# EAGLE design usbc-hub (EAGLE 9.4.2)
CNAME: PepeTech; CREVISION: 1; DESIGNER: Joao Silva

## Sheet 1 of 5: Upstream USB-C
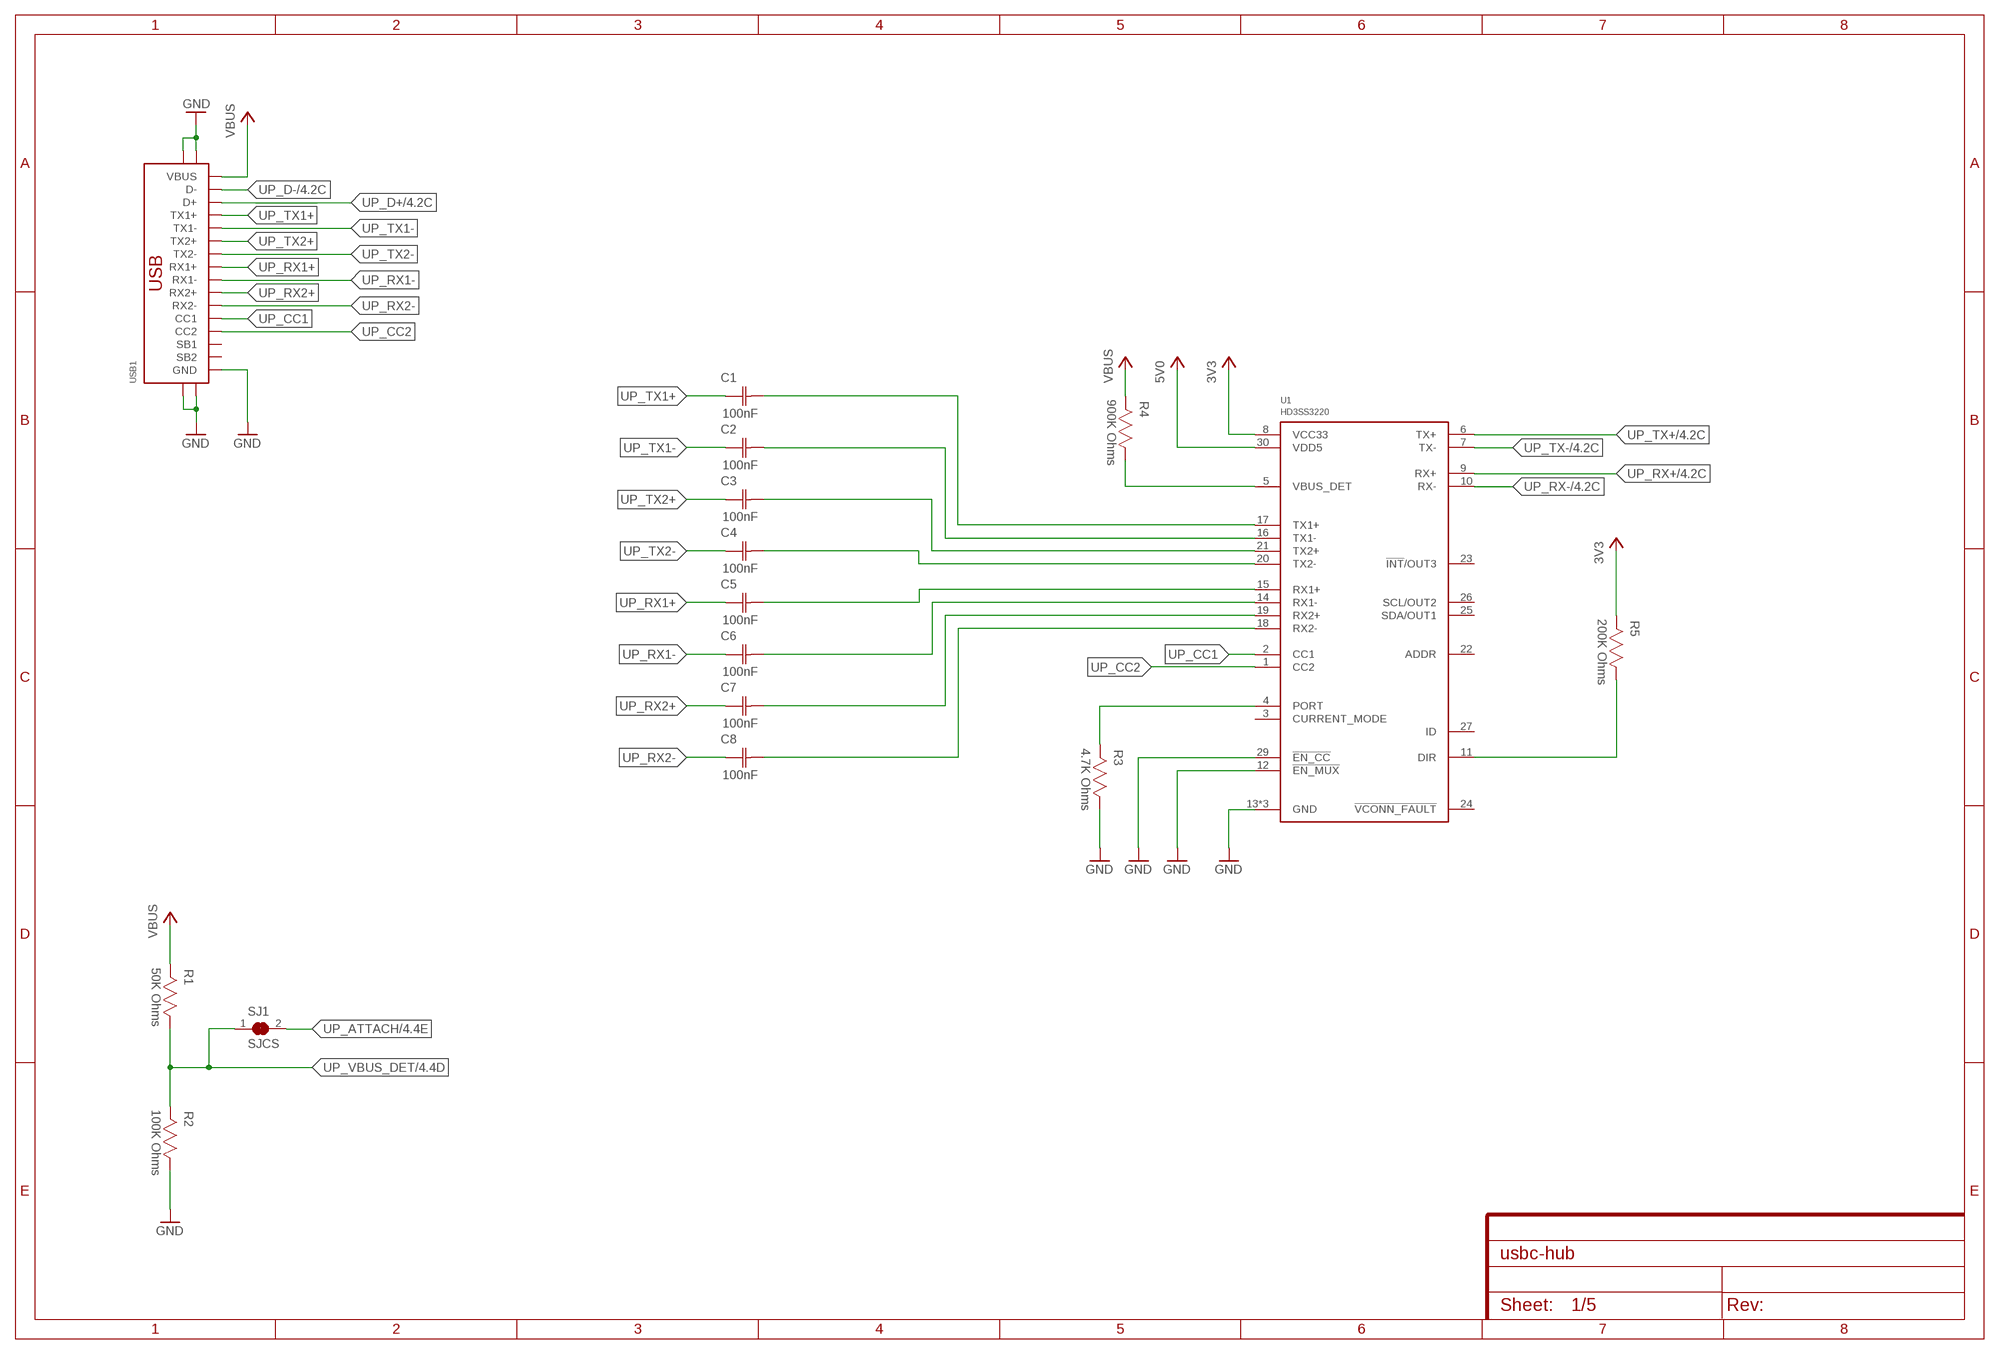
[diagram p0: schematic, sheet 1]

### Parts
C1  100nF  CAPACITOR-0603  [CAP0603]
C2  100nF  CAPACITOR-0603  [CAP0603]
C3  100nF  CAPACITOR-0603  [CAP0603]
C4  100nF  CAPACITOR-0603  [CAP0603]
C5  100nF  CAPACITOR-0603  [CAP0603]
C6  100nF  CAPACITOR-0603  [CAP0603]
C7  100nF  CAPACITOR-0603  [CAP0603]
C8  100nF  CAPACITOR-0603  [CAP0603]
R1  50K Ohms  RESISTOR-0603  [RES0603]
R2  100K Ohms  RESISTOR-0603  [RES0603]
R3  4.7K Ohms  RESISTOR-0603  [RES0603]
R4  900K Ohms  RESISTOR-0603  [RES0603]
R5  200K Ohms  RESISTOR-0603  [RES0603]
SJ1  SJCS  [SJC_S]
U1  HD3SS3220  [WQFN30]
USB1  USB-C-24P-SMD-FLAT-SIDE  [USB-C-24P-SMD-FLAT-SIDE]

### Nets
3V3: R5.2 U1.8(VCC33) ; also sheet 3,4
5V0: U1.30(VDD5) ; also sheet 3,5
DN2_PWR_EN1: R1.2 ; supply symbol labelled VBUS
GND: R2.1 R3.1 U1.12(!EN_MUX) U1.13(GND) U1.28(GND) U1.29(!EN_CC) U1.31(GND) USB1.A1(GND) USB1.A12(GND) USB1.B1(GND) USB1.B12(GND) USB1.SHIELD@0(SHIELD) USB1.SHIELD@1(SHIELD) USB1.SHIELD@2(SHIELD) USB1.SHIELD@3(SHIELD) ; also sheet 2,3,4
N$1: C1.2(C2) U1.17(TX1+)
N$2: C2.2(C2) U1.16(TX1-)
N$3: C3.2(C2) U1.21(TX2+)
N$4: C4.2(C2) U1.20(TX2-)
N$5: C5.2(C2) U1.15(RX1+)
N$6: C6.2(C2) U1.14(RX1-)
N$7: C7.2(C2) U1.19(RX2+)
N$8: C8.2(C2) U1.18(RX2-)
N$9: R4.1 U1.5(VBUS_DET)
N$10: R3.2 U1.4(PORT)
N$27: R5.1 U1.11(DIR)
UP_ATTACH: SJ1.2 ; also sheet 4
UP_CC1: U1.2(CC1) USB1.A5(CC1)
UP_CC2: U1.1(CC2) USB1.B5(CC2)
UP_D+: USB1.A6(D+) USB1.B6(D+) ; also sheet 4
UP_D-: USB1.A7(D-) USB1.B7(D-) ; also sheet 4
UP_RX1+: C5.1(C1) USB1.B11(RX1+)
UP_RX1-: C6.1(C1) USB1.B10(RX1-)
UP_RX2+: C7.1(C1) USB1.A11(RX2+)
UP_RX2-: C8.1(C1) USB1.A10(RX2-)
UP_RX+: U1.9(RX+) ; also sheet 4
UP_RX-: U1.10(RX-) ; also sheet 4
UP_TX1+: C1.1(C1) USB1.A2(TX1+)
UP_TX1-: C2.1(C1) USB1.A3(TX1-)
UP_TX2+: C3.1(C1) USB1.B2(TX2+)
UP_TX2-: C4.1(C1) USB1.B3(TX2-)
UP_TX+: U1.6(TX+) ; also sheet 4
UP_TX-: U1.7(TX-) ; also sheet 4
UP_VBUS_DET: R1.1 R2.2 SJ1.1 ; also sheet 4
VBUS: R4.2 USB1.A4(VBUS) USB1.A9(VBUS) USB1.B4(VBUS) USB1.B9(VBUS) ; also sheet 5
Unconnected: U1.3(CURRENT_MODE) U1.22(ADDR) U1.23(!INT!/OUT3) U1.24(!VCONN_FAULT) U1.25(SDA/OUT1) U1.26(SCL/OUT2) U1.27(ID) USB1.A8(SB1) USB1.B8(SB2)

## Sheet 2 of 5: Downstream Legacy
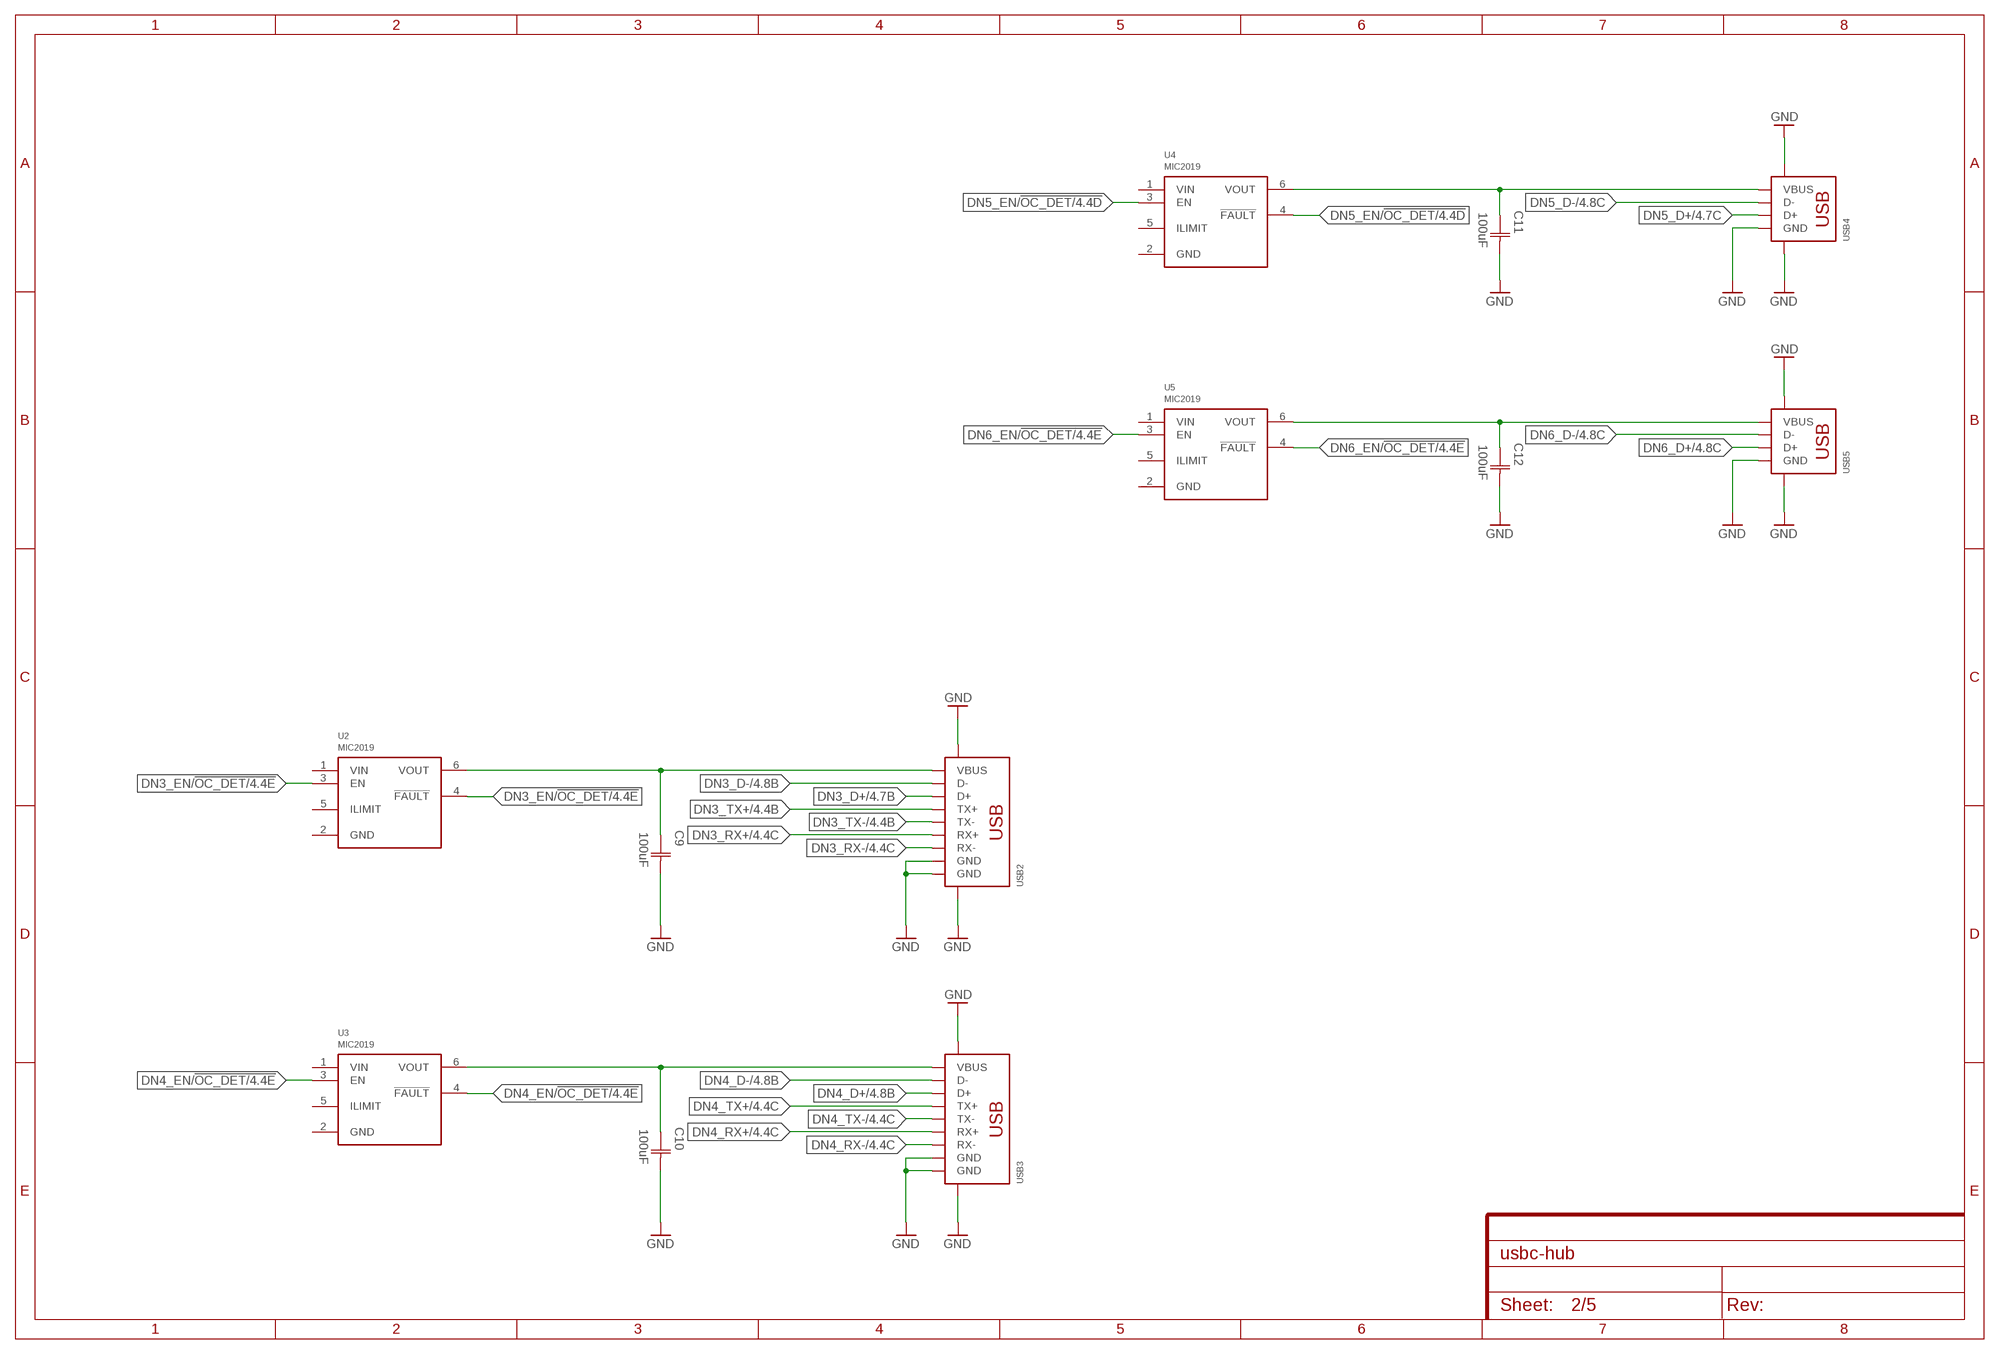
[diagram p1: schematic, sheet 2]

### Parts
C9  100uF  CAPACITOR-1206  [CAP1206]
C10  100uF  CAPACITOR-1206  [CAP1206]
C11  100uF  CAPACITOR-1206  [CAP1206]
C12  100uF  CAPACITOR-1206  [CAP1206]
U2  MIC2019  [SOT23-6]
U3  MIC2019  [SOT23-6]
U4  MIC2019  [SOT23-6]
U5  MIC2019  [SOT23-6]
USB2  USB3-A-TH-FLAT-SIDE  [USB3-A-TH-FLAT-SIDE]
USB3  USB3-A-TH-FLAT-SIDE  [USB3-A-TH-FLAT-SIDE]
USB4  USB-A-TH-FLAT-SIDE  [USB-A-TH-FLAT-SIDE]
USB5  USB-A-TH-FLAT-SIDE  [USB-A-TH-FLAT-SIDE]

### Nets
DN3_D+: USB2.D+ ; also sheet 4
DN3_D-: USB2.D- ; also sheet 4
DN3_EN/!OC_DET: U2.3(EN) U2.4(!FAULT) ; also sheet 4
DN3_RX+: USB2.RX+ ; also sheet 4
DN3_RX-: USB2.RX- ; also sheet 4
DN3_TX+: USB2.TX+ ; also sheet 4
DN3_TX-: USB2.TX- ; also sheet 4
DN4_D+: USB3.D+ ; also sheet 4
DN4_D-: USB3.D- ; also sheet 4
DN4_EN/!OC_DET: U3.3(EN) U3.4(!FAULT) ; also sheet 4
DN4_RX+: USB3.RX+ ; also sheet 4
DN4_RX-: USB3.RX- ; also sheet 4
DN4_TX+: USB3.TX+ ; also sheet 4
DN4_TX-: USB3.TX- ; also sheet 4
DN5_D+: USB4.D+ ; also sheet 4
DN5_D-: USB4.D- ; also sheet 4
DN5_EN/!OC_DET: U4.3(EN) U4.4(!FAULT) ; also sheet 4
DN6_D+: USB5.D+ ; also sheet 4
DN6_D-: USB5.D- ; also sheet 4
DN6_EN/!OC_DET: U5.3(EN) U5.4(!FAULT) ; also sheet 4
GND: C9.2(C2) C10.2(C2) C11.2(C2) C12.2(C2) USB2.GND USB2.P$10(SHIELD) USB2.P$11(SHIELD) USB2.SS_GND(GND) USB3.GND USB3.P$10(SHIELD) USB3.P$11(SHIELD) USB3.SS_GND(GND) USB4.GND USB4.P$5(SHIELD) USB4.P$6(SHIELD) USB5.GND USB5.P$5(SHIELD) USB5.P$6(SHIELD) ; also sheet 1,3,4
N$13: C9.1(C1) U2.6(VOUT) USB2.VBUS
N$14: C12.1(C1) U5.6(VOUT) USB5.VBUS
N$15: C11.1(C1) U4.6(VOUT) USB4.VBUS
N$16: C10.1(C1) U3.6(VOUT) USB3.VBUS
Unconnected: U2.1(VIN) U2.2(GND) U2.5(ILIMIT) U3.1(VIN) U3.2(GND) U3.5(ILIMIT) U4.1(VIN) U4.2(GND) U4.5(ILIMIT) U5.1(VIN) U5.2(GND) U5.5(ILIMIT)

## Sheet 3 of 5: Downstream USB-C
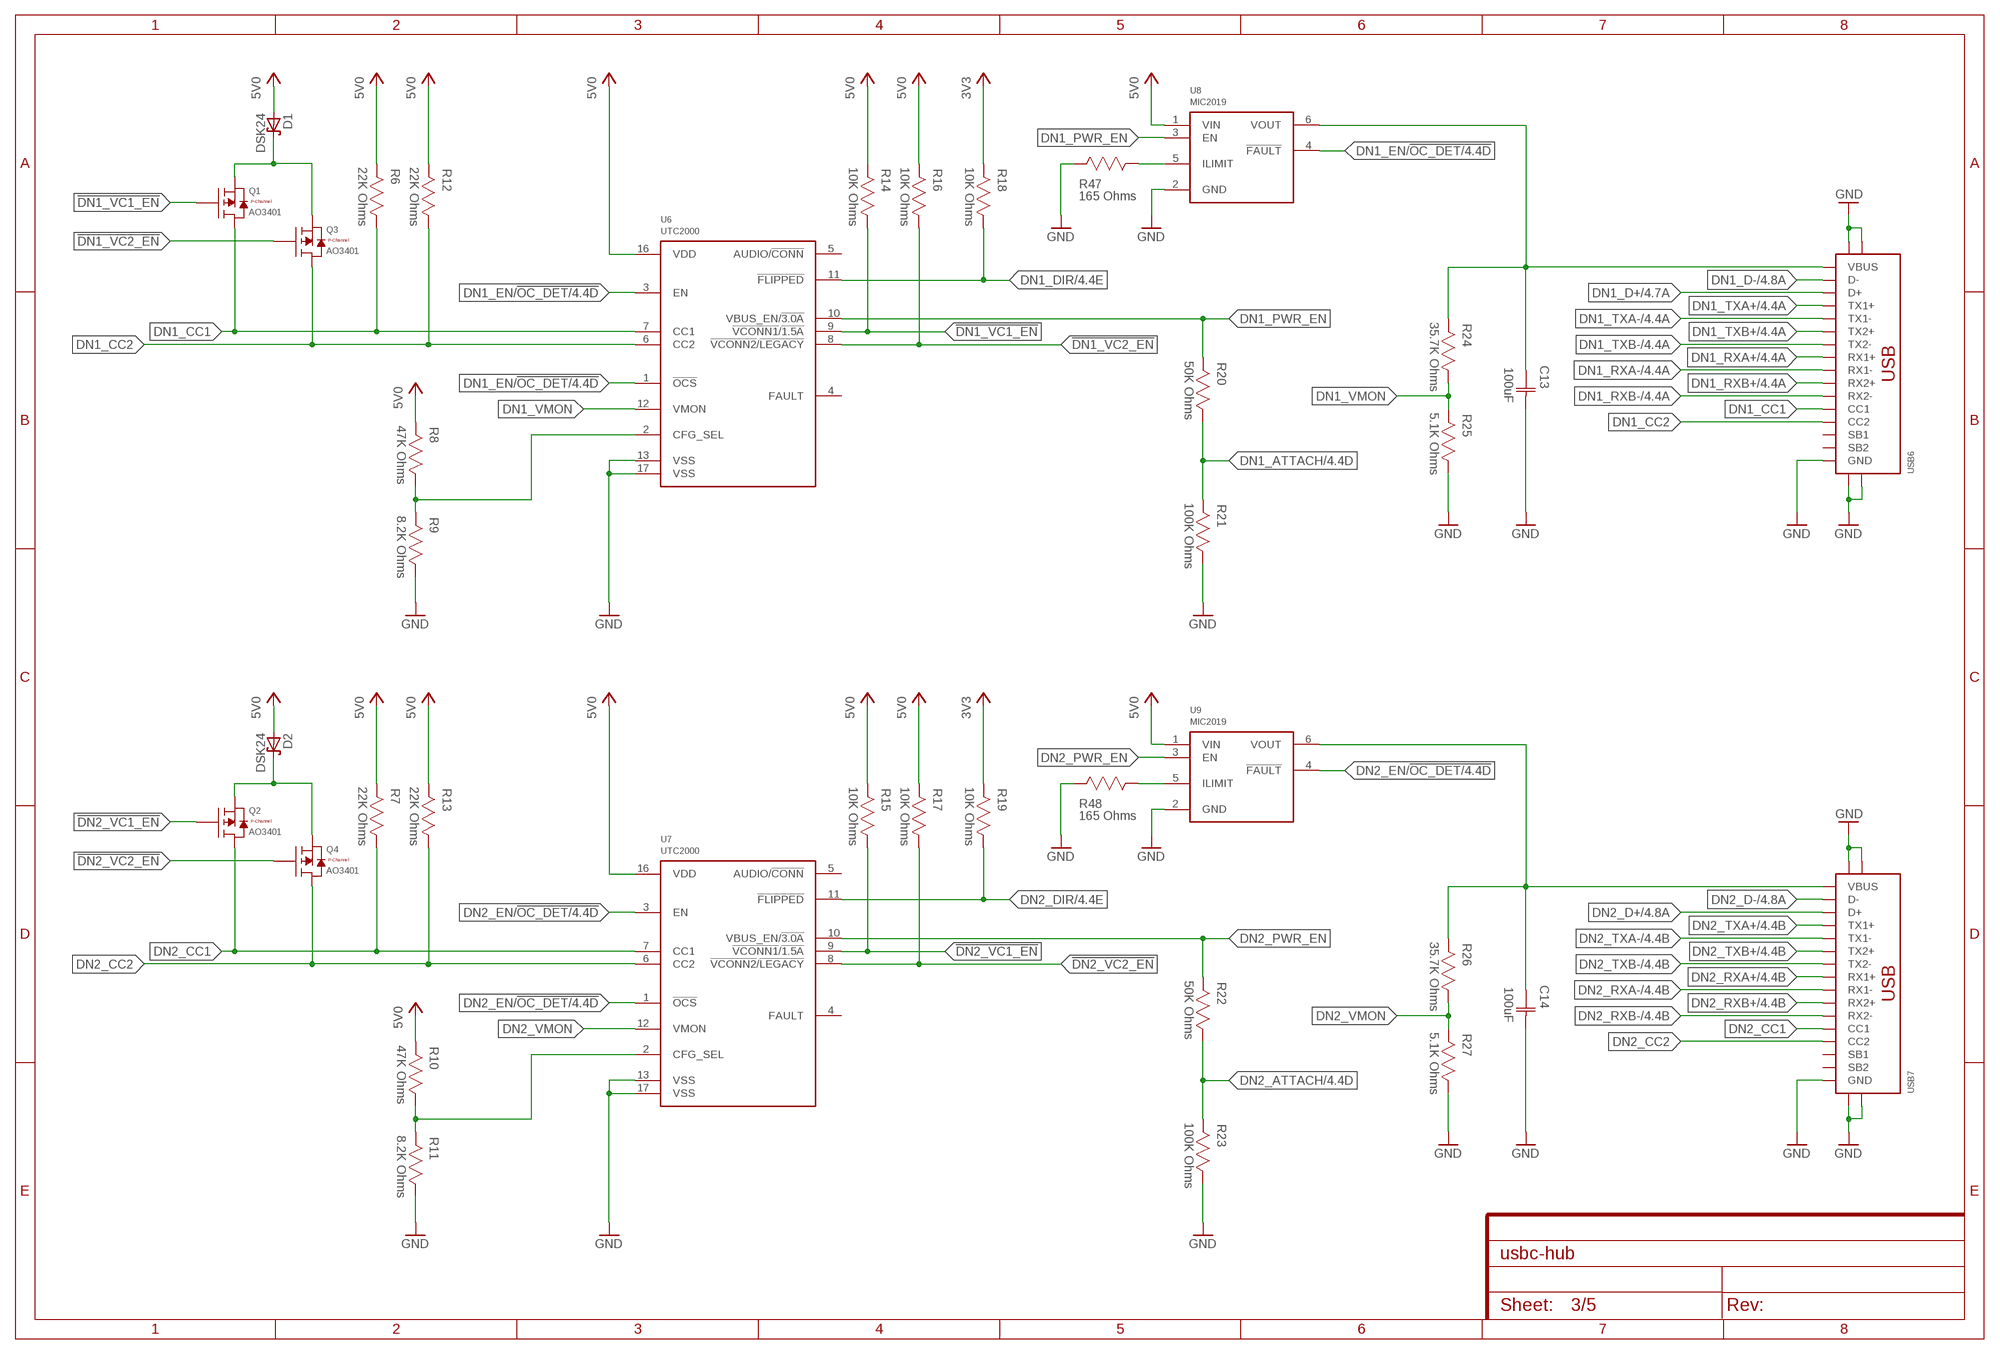
[diagram p2: schematic, sheet 3]

### Parts
C13  100uF  CAPACITOR-1206  [CAP1206]
C14  100uF  CAPACITOR-1206  [CAP1206]
D1  DSK24  [SOD-123F]
D2  DSK24  [SOD-123F]
Q1  AO3401  [SOT23]
Q2  AO3401  [SOT23]
Q3  AO3401  [SOT23]
Q4  AO3401  [SOT23]
R6  22K Ohms  RESISTOR-0603  [RES0603]
R7  22K Ohms  RESISTOR-0603  [RES0603]
R8  47K Ohms  RESISTOR-0603  [RES0603]
R9  8.2K Ohms  RESISTOR-0603  [RES0603]
R10  47K Ohms  RESISTOR-0603  [RES0603]
R11  8.2K Ohms  RESISTOR-0603  [RES0603]
R12  22K Ohms  RESISTOR-0603  [RES0603]
R13  22K Ohms  RESISTOR-0603  [RES0603]
R14  10K Ohms  RESISTOR-0603  [RES0603]
R15  10K Ohms  RESISTOR-0603  [RES0603]
R16  10K Ohms  RESISTOR-0603  [RES0603]
R17  10K Ohms  RESISTOR-0603  [RES0603]
R18  10K Ohms  RESISTOR-0603  [RES0603]
R19  10K Ohms  RESISTOR-0603  [RES0603]
R20  50K Ohms  RESISTOR-0603  [RES0603]
R21  100K Ohms  RESISTOR-0603  [RES0603]
R22  50K Ohms  RESISTOR-0603  [RES0603]
R23  100K Ohms  RESISTOR-0603  [RES0603]
R24  35.7K Ohms  RESISTOR-0603  [RES0603]
R25  5.1K Ohms  RESISTOR-0603  [RES0603]
R26  35.7K Ohms  RESISTOR-0603  [RES0603]
R27  5.1K Ohms  RESISTOR-0603  [RES0603]
R47  165 Ohms  RESISTOR-0603  [RES0603]
R48  165 Ohms  RESISTOR-0603  [RES0603]
U6  UTC2000  [QFN16]
U7  UTC2000  [QFN16]
U8  MIC2019  [SOT23-6]
U9  MIC2019  [SOT23-6]
USB6  USB-C-24P-SMD-FLAT-SIDE  [USB-C-24P-SMD-FLAT-SIDE]
USB7  USB-C-24P-SMD-FLAT-SIDE  [USB-C-24P-SMD-FLAT-SIDE]

### Nets
3V3: R18.2 R19.2 ; also sheet 1,4
5V0: D1.A D2.A R6.2 R7.2 R8.2 R10.2 R12.2 R13.2 R14.2 R15.2 R16.2 R17.2 U6.16(VDD) U7.16(VDD) U8.1(VIN) U9.1(VIN) ; also sheet 1,5
!DN1_VC1_EN: Q1.1(G) R14.1 U6.9(!VCONN1!/!1.5A)
!DN1_VC2_EN: Q3.1(G) R16.1 U6.8(!VCONN2!/!LEGACY)
!DN2_VC1_EN: Q2.1(G) R15.1 U7.9(!VCONN1!/!1.5A)
!DN2_VC2_EN: Q4.1(G) R17.1 U7.8(!VCONN2!/!LEGACY)
DN1_ATTACH: R20.1 R21.2 ; also sheet 4
DN1_CC1: Q1.3(D) R6.1 U6.7(CC1) USB6.A5(CC1)
DN1_CC2: Q3.3(D) R12.1 U6.6(CC2) USB6.B5(CC2)
DN1_D+: USB6.A6(D+) USB6.B6(D+) ; also sheet 4
DN1_D-: USB6.A7(D-) USB6.B7(D-) ; also sheet 4
DN1_DIR: R18.1 U6.11(!FLIPPED) ; also sheet 4
DN1_EN/!OC_DET: U6.1(!OCS) U6.3(EN) U8.4(!FAULT) ; also sheet 4
DN1_PWR_EN: R20.2 U6.10(VBUS_EN/!3.0A) U8.3(EN)
DN1_RXA+: USB6.B11(RX1+) ; also sheet 4
DN1_RXA-: USB6.B10(RX1-) ; also sheet 4
DN1_RXB+: USB6.A11(RX2+) ; also sheet 4
DN1_RXB-: USB6.A10(RX2-) ; also sheet 4
DN1_TXA+: USB6.A2(TX1+) ; also sheet 4
DN1_TXA-: USB6.A3(TX1-) ; also sheet 4
DN1_TXB+: USB6.B2(TX2+) ; also sheet 4
DN1_TXB-: USB6.B3(TX2-) ; also sheet 4
DN1_VMON: R24.1 R25.2 U6.12(VMON)
DN2_ATTACH: R22.1 R23.2 ; also sheet 4
DN2_CC1: Q2.3(D) R7.1 U7.7(CC1) USB7.A5(CC1)
DN2_CC2: Q4.3(D) R13.1 U7.6(CC2) USB7.B5(CC2)
DN2_D+: USB7.A6(D+) USB7.B6(D+) ; also sheet 4
DN2_D-: USB7.A7(D-) USB7.B7(D-) ; also sheet 4
DN2_DIR: R19.1 U7.11(!FLIPPED) ; also sheet 4
DN2_EN/!OC_DET: U7.1(!OCS) U7.3(EN) U9.4(!FAULT) ; also sheet 4
DN2_PWR_EN: R22.2 U7.10(VBUS_EN/!3.0A) U9.3(EN)
DN2_RXA+: USB7.B11(RX1+) ; also sheet 4
DN2_RXA-: USB7.B10(RX1-) ; also sheet 4
DN2_RXB+: USB7.A11(RX2+) ; also sheet 4
DN2_RXB-: USB7.A10(RX2-) ; also sheet 4
DN2_TXA+: USB7.A2(TX1+) ; also sheet 4
DN2_TXA-: USB7.A3(TX1-) ; also sheet 4
DN2_TXB+: USB7.B2(TX2+) ; also sheet 4
DN2_TXB-: USB7.B3(TX2-) ; also sheet 4
DN2_VMON: R26.1 R27.2 U7.12(VMON)
GND: C13.2(C2) C14.2(C2) R9.1 R11.1 R21.1 R23.1 R25.1 R27.1 R47.2 R48.2 U6.13(VSS) U6.17(VSS) U7.13(VSS) U7.17(VSS) U8.2(GND) U9.2(GND) USB6.A1(GND) USB6.A12(GND) USB6.B1(GND) USB6.B12(GND) USB6.SHIELD@0(SHIELD) USB6.SHIELD@1(SHIELD) USB6.SHIELD@2(SHIELD) USB6.SHIELD@3(SHIELD) USB7.A1(GND) USB7.A12(GND) USB7.B1(GND) USB7.B12(GND) USB7.SHIELD@0(SHIELD) USB7.SHIELD@1(SHIELD) USB7.SHIELD@2(SHIELD) USB7.SHIELD@3(SHIELD) ; also sheet 1,2,4
N$11: C14.1(C1) U9.6(VOUT) USB7.A4(VBUS) USB7.A9(VBUS) USB7.B4(VBUS) USB7.B9(VBUS)
N$12: C13.1(C1) R24.2 U8.6(VOUT) USB6.A4(VBUS) USB6.A9(VBUS) USB6.B4(VBUS) USB6.B9(VBUS)
N$21: D2.C Q2.2(S) Q4.2(S)
N$23: D1.C Q1.2(S) Q3.2(S)
N$24: R10.1 R11.2 U7.2(CFG_SEL)
N$25: R8.1 R9.2 U6.2(CFG_SEL)
N$26: R26.2
N$28: R47.1 U8.5(ILIMIT)
N$29: R48.1 U9.5(ILIMIT)
Unconnected: U6.4(FAULT) U6.5(AUDIO/!CONN) U7.4(FAULT) U7.5(AUDIO/!CONN) USB6.A8(SB1) USB6.B8(SB2) USB7.A8(SB1) USB7.B8(SB2)

## Sheet 4 of 5: Hub
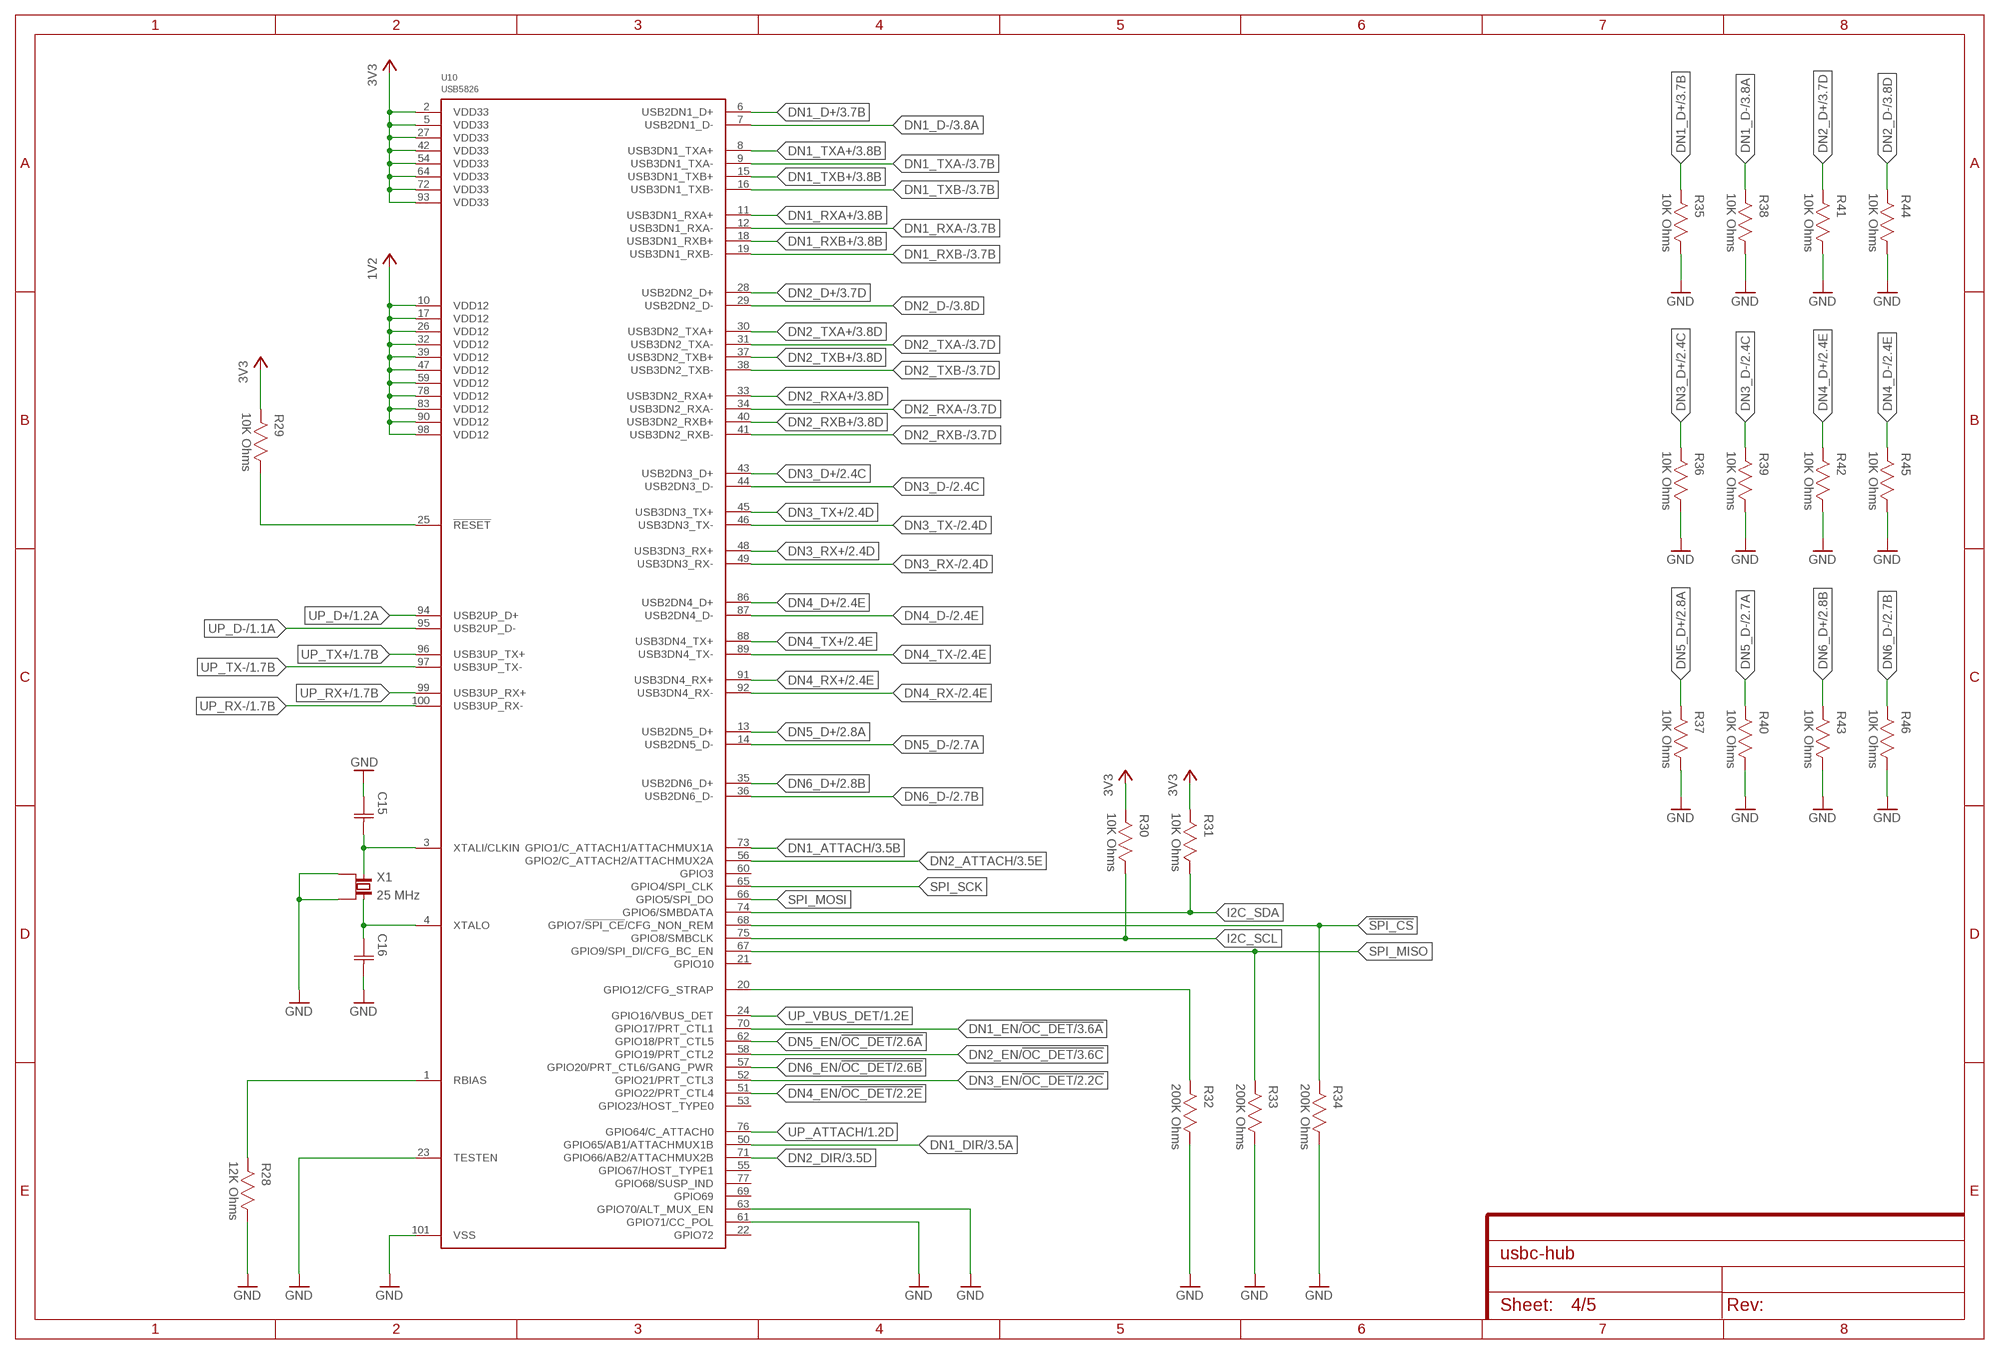
[diagram p3: schematic, sheet 4]

### Parts
C15  CAPACITOR-0603  [CAP0603]
C16  CAPACITOR-0603  [CAP0603]
R28  12K Ohms  RESISTOR-0603  [RES0603]
R29  10K Ohms  RESISTOR-0603  [RES0603]
R30  10K Ohms  RESISTOR-0603  [RES0603]
R31  10K Ohms  RESISTOR-0603  [RES0603]
R32  200K Ohms  RESISTOR-0603  [RES0603]
R33  200K Ohms  RESISTOR-0603  [RES0603]
R34  200K Ohms  RESISTOR-0603  [RES0603]
R35  10K Ohms  RESISTOR-0603  [RES0603]
R36  10K Ohms  RESISTOR-0603  [RES0603]
R37  10K Ohms  RESISTOR-0603  [RES0603]
R38  10K Ohms  RESISTOR-0603  [RES0603]
R39  10K Ohms  RESISTOR-0603  [RES0603]
R40  10K Ohms  RESISTOR-0603  [RES0603]
R41  10K Ohms  RESISTOR-0603  [RES0603]
R42  10K Ohms  RESISTOR-0603  [RES0603]
R43  10K Ohms  RESISTOR-0603  [RES0603]
R44  10K Ohms  RESISTOR-0603  [RES0603]
R45  10K Ohms  RESISTOR-0603  [RES0603]
R46  10K Ohms  RESISTOR-0603  [RES0603]
U10  USB5826  [VQFN100]
X1  25 MHz  CRYSTAL_4P  [4-SMD-3225]

### Nets
1V2: U10.10(VDD12) U10.17(VDD12) U10.26(VDD12) U10.32(VDD12) U10.39(VDD12) U10.47(VDD12) U10.59(VDD12) U10.78(VDD12) U10.83(VDD12) U10.90(VDD12) U10.98(VDD12)
3V3: R29.2 R30.2 R31.2 U10.2(VDD33) U10.5(VDD33) U10.27(VDD33) U10.42(VDD33) U10.54(VDD33) U10.64(VDD33) U10.72(VDD33) U10.93(VDD33) ; also sheet 1,3
!SPI_CS: R34.2 U10.68(GPIO7/!SPI_CE!/CFG_NON_REM)
DN1_ATTACH: U10.73(GPIO1/C_ATTACH1/ATTACHMUX1A) ; also sheet 3
DN1_D+: R35.2 U10.6(USB2DN1_D+) ; also sheet 3
DN1_D-: R38.2 U10.7(USB2DN1_D-) ; also sheet 3
DN1_DIR: U10.50(GPIO65/AB1/ATTACHMUX1B) ; also sheet 3
DN1_EN/!OC_DET: U10.70(GPIO17/PRT_CTL1) ; also sheet 3
DN1_RXA+: U10.11(USB3DN1_RXA+) ; also sheet 3
DN1_RXA-: U10.12(USB3DN1_RXA-) ; also sheet 3
DN1_RXB+: U10.18(USB3DN1_RXB+) ; also sheet 3
DN1_RXB-: U10.19(USB3DN1_RXB-) ; also sheet 3
DN1_TXA+: U10.8(USB3DN1_TXA+) ; also sheet 3
DN1_TXA-: U10.9(USB3DN1_TXA-) ; also sheet 3
DN1_TXB+: U10.15(USB3DN1_TXB+) ; also sheet 3
DN1_TXB-: U10.16(USB3DN1_TXB-) ; also sheet 3
DN2_ATTACH: U10.56(GPIO2/C_ATTACH2/ATTACHMUX2A) ; also sheet 3
DN2_D+: R41.2 U10.28(USB2DN2_D+) ; also sheet 3
DN2_D-: R44.2 U10.29(USB2DN2_D-) ; also sheet 3
DN2_DIR: U10.71(GPIO66/AB2/ATTACHMUX2B) ; also sheet 3
DN2_EN/!OC_DET: U10.58(GPIO19/PRT_CTL2) ; also sheet 3
DN2_RXA+: U10.33(USB3DN2_RXA+) ; also sheet 3
DN2_RXA-: U10.34(USB3DN2_RXA-) ; also sheet 3
DN2_RXB+: U10.40(USB3DN2_RXB+) ; also sheet 3
DN2_RXB-: U10.41(USB3DN2_RXB-) ; also sheet 3
DN2_TXA+: U10.30(USB3DN2_TXA+) ; also sheet 3
DN2_TXA-: U10.31(USB3DN2_TXA-) ; also sheet 3
DN2_TXB+: U10.37(USB3DN2_TXB+) ; also sheet 3
DN2_TXB-: U10.38(USB3DN2_TXB-) ; also sheet 3
DN3_D+: R36.2 U10.43(USB2DN3_D+) ; also sheet 2
DN3_D-: R39.2 U10.44(USB2DN3_D-) ; also sheet 2
DN3_EN/!OC_DET: U10.52(GPIO21/PRT_CTL3) ; also sheet 2
DN3_RX+: U10.48(USB3DN3_RX+) ; also sheet 2
DN3_RX-: U10.49(USB3DN3_RX-) ; also sheet 2
DN3_TX+: U10.45(USB3DN3_TX+) ; also sheet 2
DN3_TX-: U10.46(USB3DN3_TX-) ; also sheet 2
DN4_D+: R42.2 U10.86(USB2DN4_D+) ; also sheet 2
DN4_D-: R45.2 U10.87(USB2DN4_D-) ; also sheet 2
DN4_EN/!OC_DET: U10.51(GPIO22/PRT_CTL4) ; also sheet 2
DN4_RX+: U10.91(USB3DN4_RX+) ; also sheet 2
DN4_RX-: U10.92(USB3DN4_RX-) ; also sheet 2
DN4_TX+: U10.88(USB3DN4_TX+) ; also sheet 2
DN4_TX-: U10.89(USB3DN4_TX-) ; also sheet 2
DN5_D+: R37.2 U10.13(USB2DN5_D+) ; also sheet 2
DN5_D-: R40.2 U10.14(USB2DN5_D-) ; also sheet 2
DN5_EN/!OC_DET: U10.62(GPIO18/PRT_CTL5) ; also sheet 2
DN6_D+: R43.2 U10.35(USB2DN6_D+) ; also sheet 2
DN6_D-: R46.2 U10.36(USB2DN6_D-) ; also sheet 2
DN6_EN/!OC_DET: U10.57(GPIO20/PRT_CTL6/GANG_PWR) ; also sheet 2
GND: C15.1(C1) C16.2(C2) R28.1 R32.1 R33.1 R34.1 R35.1 R36.1 R37.1 R38.1 R39.1 R40.1 R41.1 R42.1 R43.1 R44.1 R45.1 R46.1 U10.23(TESTEN) U10.61(GPIO71/CC_POL) U10.63(GPIO70/ALT_MUX_EN) U10.101(VSS) X1.2(GND) X1.4(GND) ; also sheet 1,2,3
I2C_SCL: R30.1 U10.75(GPIO8/SMBCLK)
I2C_SDA: R31.1 U10.74(GPIO6/SMBDATA)
N$17: C16.1(C1) U10.4(XTALO) X1.3
N$18: C15.2(C2) U10.3(XTALI/CLKIN) X1.1
N$19: R32.2 U10.20(GPIO12/CFG_STRAP)
N$20: R29.1 U10.25(!RESET)
N$22: R28.2 U10.1(RBIAS)
SPI_MISO: R33.2 U10.67(GPIO9/SPI_DI/CFG_BC_EN)
SPI_MOSI: U10.66(GPIO5/SPI_DO)
SPI_SCK: U10.65(GPIO4/SPI_CLK)
UP_ATTACH: U10.76(GPIO64/C_ATTACH0) ; also sheet 1
UP_D+: U10.94(USB2UP_D+) ; also sheet 1
UP_D-: U10.95(USB2UP_D-) ; also sheet 1
UP_RX+: U10.99(USB3UP_RX+) ; also sheet 1
UP_RX-: U10.100(USB3UP_RX-) ; also sheet 1
UP_TX+: U10.96(USB3UP_TX+) ; also sheet 1
UP_TX-: U10.97(USB3UP_TX-) ; also sheet 1
UP_VBUS_DET: U10.24(GPIO16/VBUS_DET) ; also sheet 1
Unconnected: U10.21(GPIO10) U10.22(GPIO72) U10.53(GPIO23/HOST_TYPE0) U10.55(GPIO67/HOST_TYPE1) U10.60(GPIO3) U10.69(GPIO69) U10.77(GPIO68/SUSP_IND)

## Sheet 5 of 5: Power
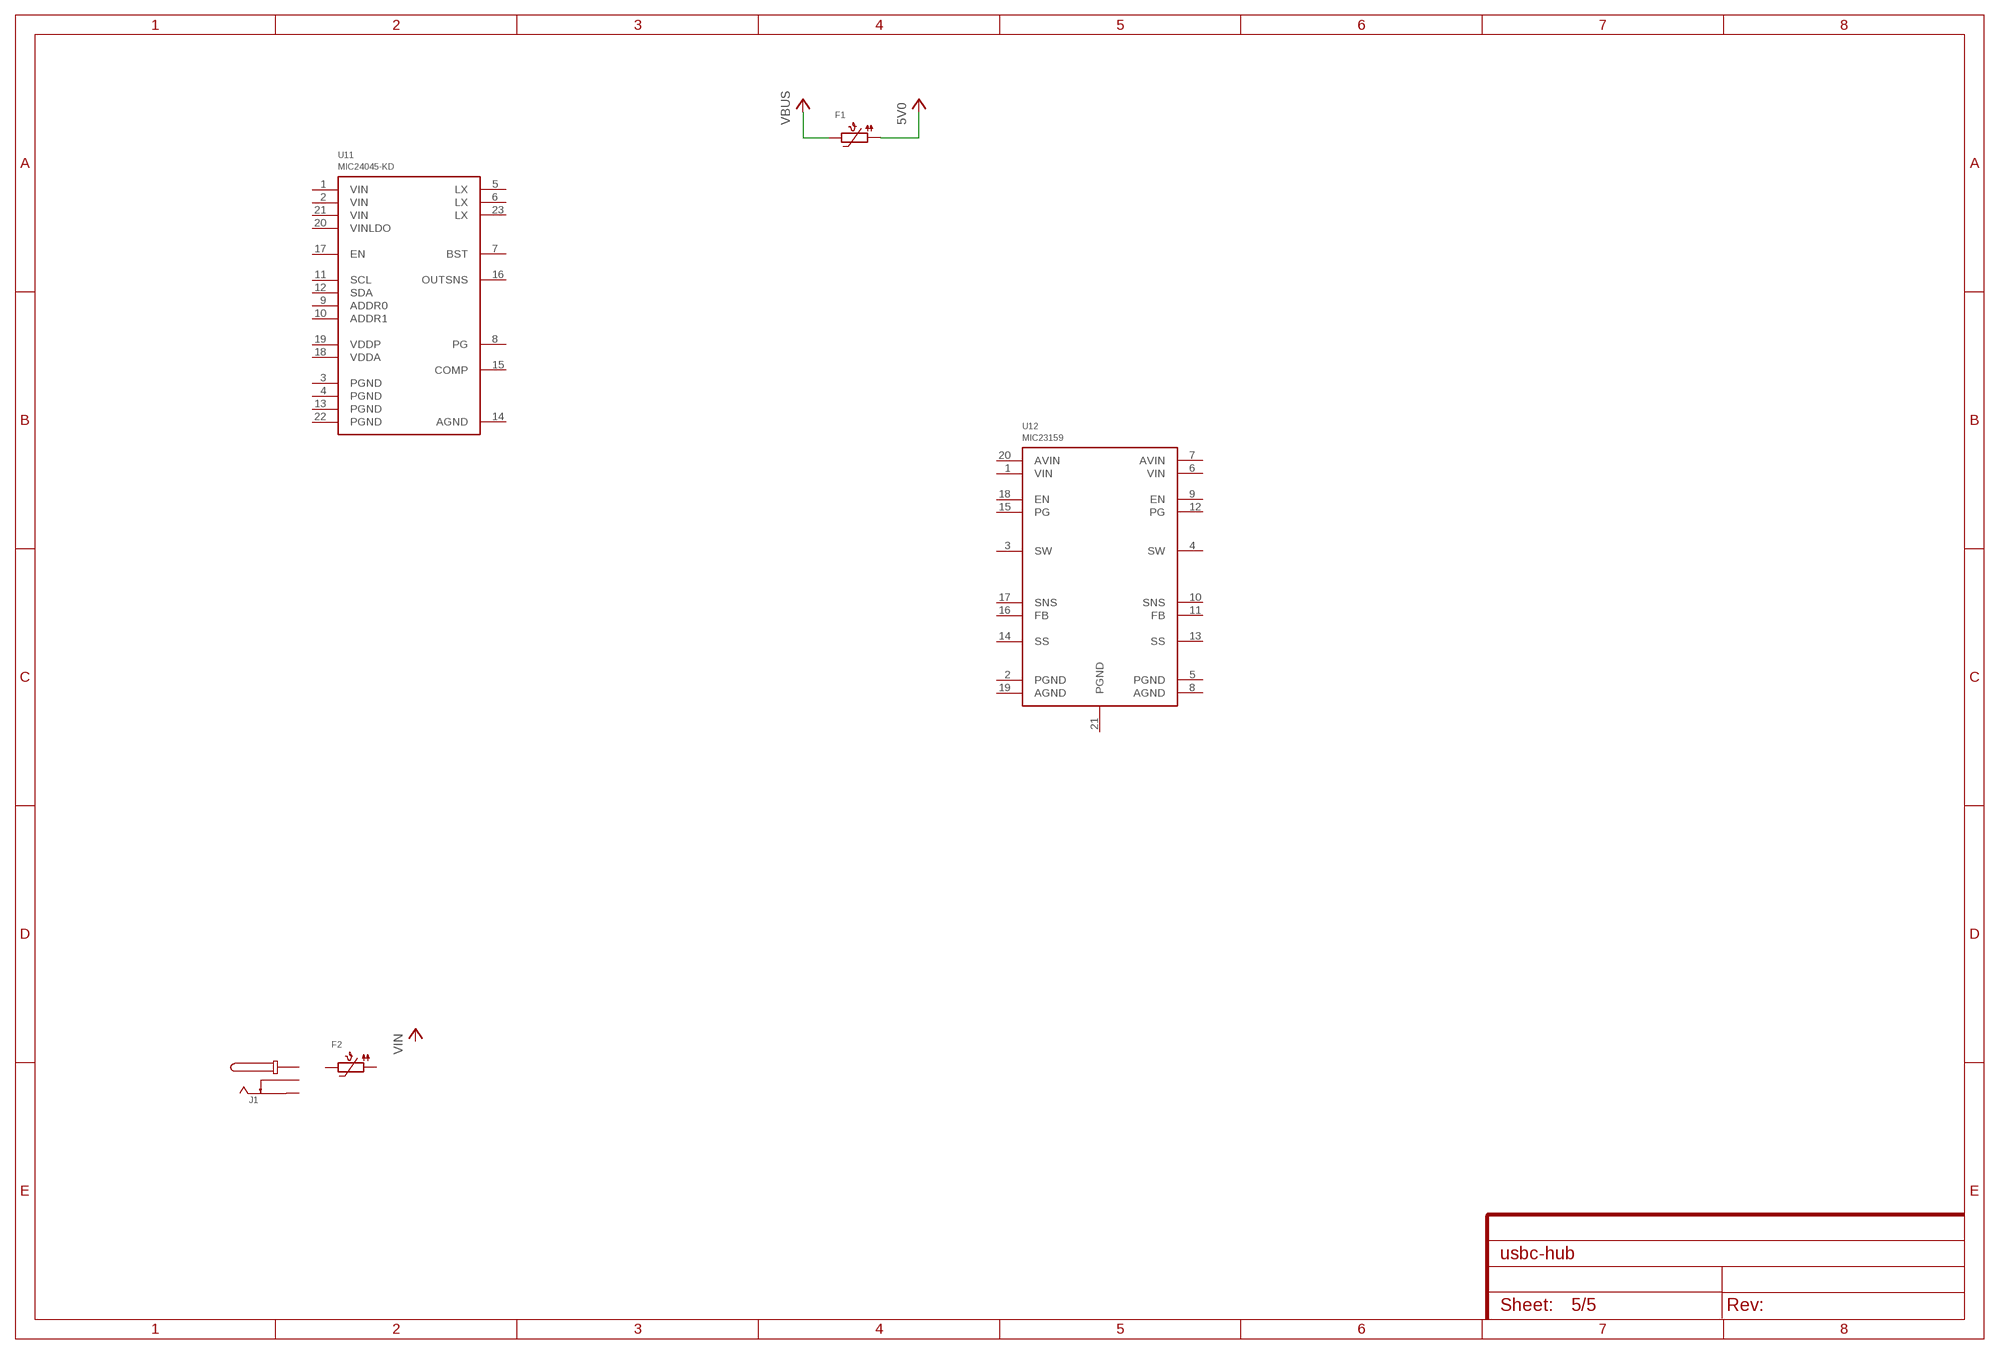
[diagram p4: schematic, sheet 5]

### Parts
F1  PTC1812  [1812]
F2  PTC1812  [1812]
J1  DCJACK  [DC-050]
U11  MIC24045-KD  [FQFN20]
U12  MIC23159  [VQFN20]

### Nets
5V0: F1.1 ; also sheet 1,3
VBUS: F1.2 ; also sheet 1
Unconnected: F2.1 F2.2 J1.C J1.C'(C) J1.DT J1.O U11.1(VIN) U11.2(VIN) U11.3(PGND) U11.4(PGND) U11.5(LX) U11.6(LX) U11.7(BST) U11.8(PG) U11.9(ADDR0) U11.10(ADDR1) U11.11(SCL) U11.12(SDA) U11.13(PGND) U11.14(AGND) U11.15(COMP) U11.16(OUTSNS) U11.17(EN) U11.18(VDDA) U11.19(VDDP) U11.20(VINLDO) U11.21(VIN) U11.22(PGND) U11.23(LX) U12.1(VIN) U12.2(PGND) U12.3(SW) U12.4(SW) U12.5(PGND) U12.6(VIN) U12.7(AVIN) U12.8(AGND) U12.9(EN) U12.10(SNS) U12.11(FB) U12.12(PG) U12.13(SS) U12.14(SS) U12.15(PG) U12.16(FB) U12.17(SNS) U12.18(EN) U12.19(AGND) U12.20(AVIN) U12.21(PGND)

## Library data of the parts
C1-C16 = Capacitor:CAPACITOR
D1 D2 = Generic Diode:DSK24
F1 F2 = PTC Fuses:PTC
J1 = DC Jack:DCJACK
Q1-Q4 = Alpha Omega:AO3401
R1-R48 = Resistor:RESISTOR
SJ1 = Solder Jumper:SJC
U1 = Texas Instruments:HD3SS3220
U2-U5 U8 U9 = Microchip:MIC20*9
U6 U7 = Microchip:UTC2000
U10 = Microchip:USB5826
U11 = Microchip:MIC24045-*
U12 = Microchip:MIC23159
USB1 USB6 USB7 = USB Connector:USB-C-24P-SMD-FLAT-SIDE
USB2 USB3 = USB Connector:USB3-A-TH-FLAT-SIDE
USB4 USB5 = USB Connector:USB-A-TH-FLAT-SIDE
X1 = Crystal:CRYSTAL_4P

## Board
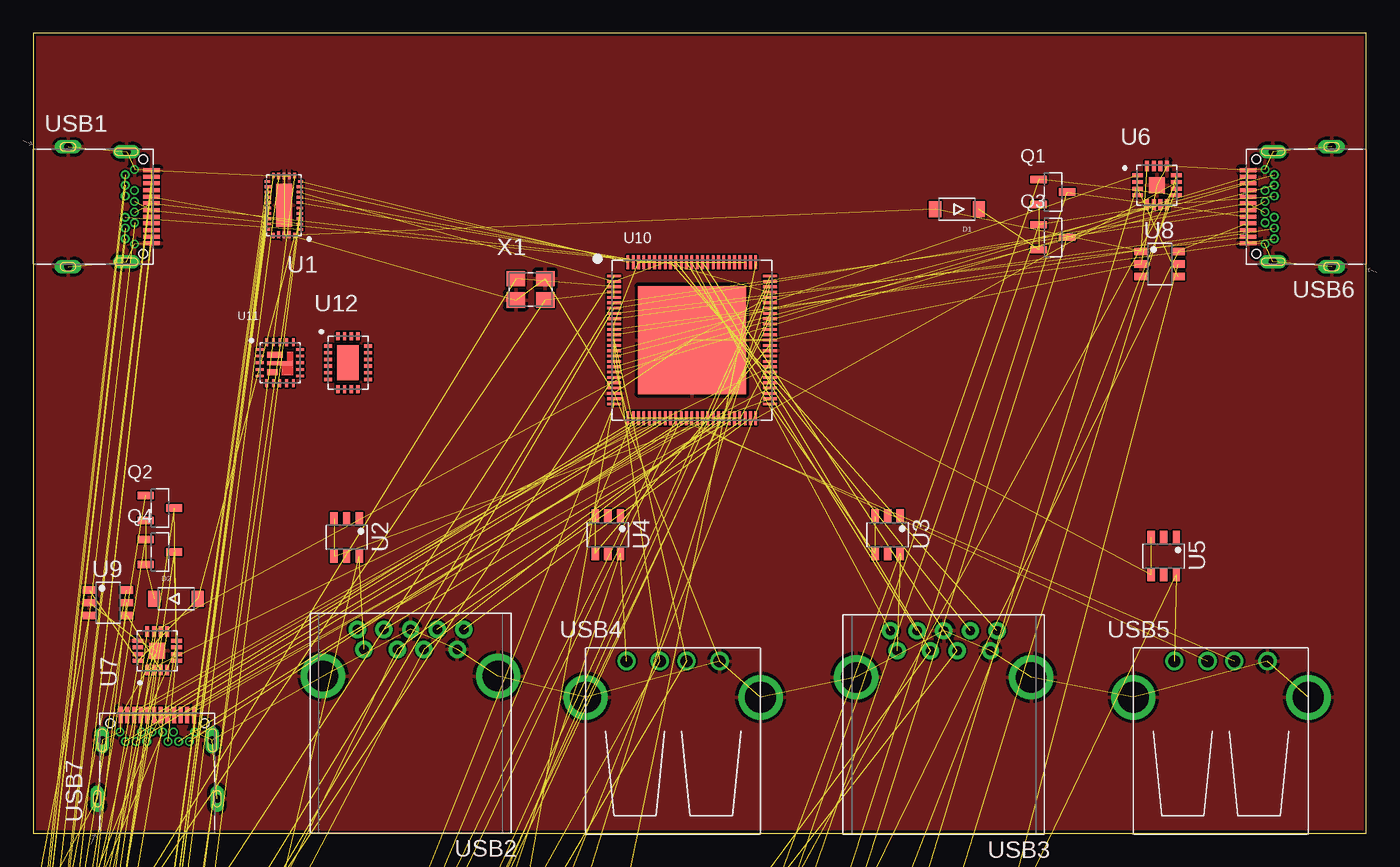
[diagram p5: board, top side]
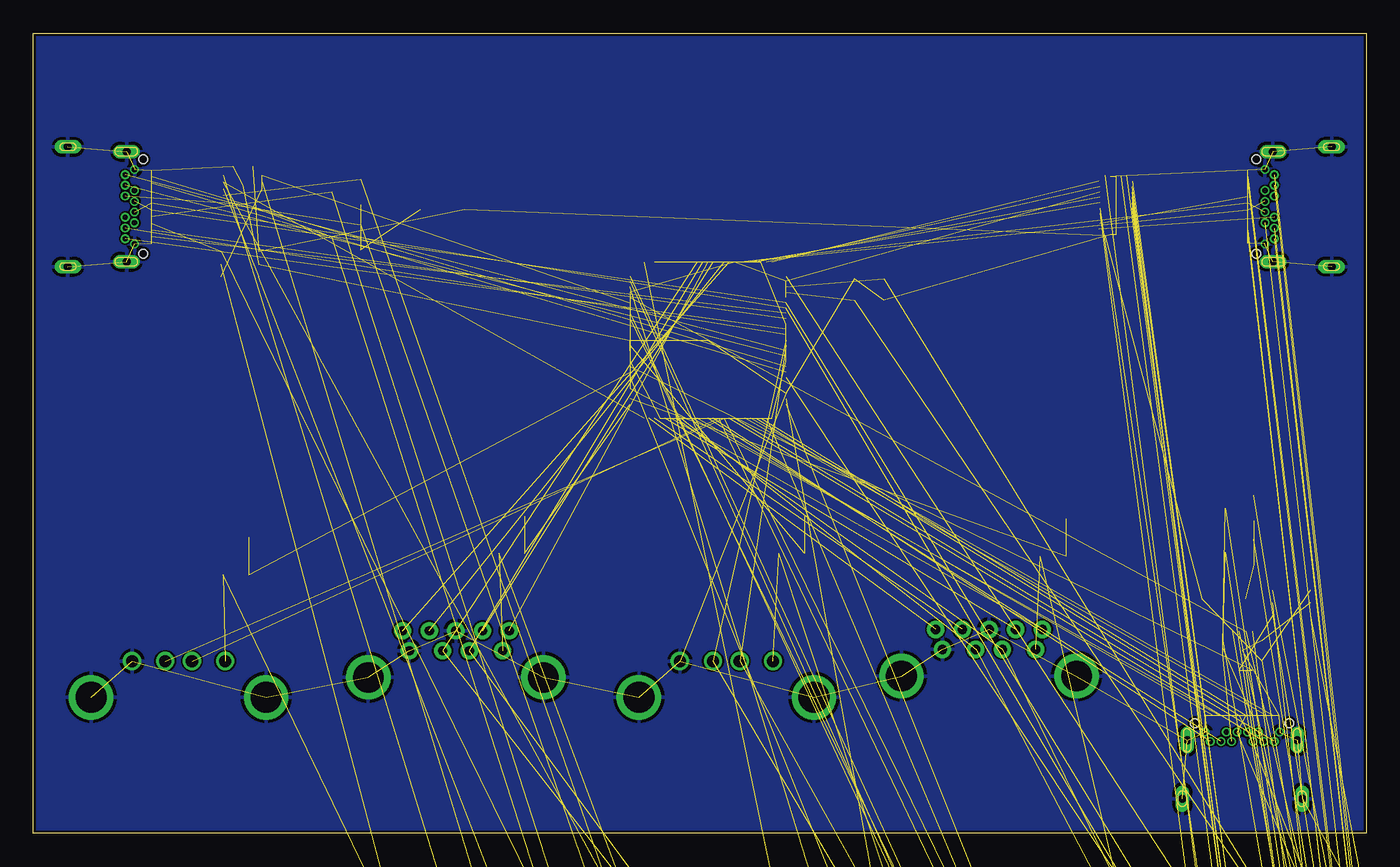
[diagram p6: board, bottom side, seen from below]

Size 100 x 60 mm. Coordinates in mm from the lower left corner, seen from the top.
Outline: 0,0 100,0 100,60 0,60 0,0
Copper layers (1*16): Top 0.035mm / dielectric 1.6mm / Bottom 0.035mm
Design rules "jlcpcb *": minimum track width 5mil, minimum drill 0.3mm, track to track 5mil, track to pad 5mil, pad to pad 5mil, via to via 5mil, smd to smd 5mil, copper to edge 0.2mm, drill to drill 5mil, minimum pad ring 3mil, minimum via ring 3mil, stop-mask expansion 4mil, vias tented up to drill 10mm, thermal gap 10mil

### Footprints (pad centres in the part's own frame; a part is rotated, then mirrored left to right if it is on the bottom)
CAP0603 = smd 0.889 x 1.016: 1 -0.819,0; 2 0.819,0
CAP1206 = smd 1.27 x 1.778: 1 -1.549,0; 2 1.549,0
SOD-123F = smd 0.91 x 1.22: A 1.637,0; C -1.637,0
1812 = smd 1.7 x 3.7: 1 -2.2,0; 2 2.2,0
DC-050 = smd 2.8 x 2.8: C 5.7,3.05; C' 5.7,-3.05; DT -5.7,-3.05; O -5.7,3.05 | hole 1.6: 0,-3.05; 0,1.45
SOT23 = smd 1.219 x 0.533: 1 -1.067,0.94; 2 -1.067,-0.94; 3 1.067,0
RES0603 = smd 0.889 x 1.016: 1 -0.819,0; 2 0.819,0
SJC_S = smd 0.635 x 1.27: 1 -0.508,0; 2 0.508,0
WQFN30 = smd 0.4 x 0.2: 1 -1.25,1.8; 10 -1.25,-1.8; 16 1.25,-1.8; 25 1.25,1.8 | smd 0.5 x 0.2: 2 -1.2,1.4; 3 -1.2,1; 4 -1.2,0.6; 5 -1.2,0.2; 6 -1.2,-0.2; 7 -1.2,-0.6; 8 -1.2,-1; 9 -1.2,-1.4; 17 1.2,-1.4; 18 1.2,-1; 19 1.2,-0.6; 20 1.2,-0.2; 21 1.2,0.2; 22 1.2,0.6; 23 1.2,1; 24 1.2,1.4 | smd 0.2 x 0.4: 11 -0.8,-2.25; 15 0.8,-2.25; 26 0.8,2.25; 30 -0.8,2.25 | smd 0.2 x 0.5: 12 -0.4,-2.2; 13 0,-2.2; 14 0.4,-2.2; 27 0.4,2.2; 28 0,2.2; 29 -0.4,2.2 | smd 1.2 x 3.2: 31 0,0
SOT23-6 = smd 1 x 0.55: 1 -1.4,0.95; 2 -1.4,0; 3 -1.4,-0.95; 4 1.4,-0.95; 5 1.4,0; 6 1.4,0.95
QFN16 = smd 0.8 x 0.3: 1 -1.45,0.75; 2 -1.45,0.25; 3 -1.45,-0.25; 4 -1.45,-0.75; 9 1.45,-0.75; 10 1.45,-0.25; 11 1.45,0.25; 12 1.45,0.75 | smd 0.3 x 0.8: 5 -0.75,-1.45; 6 -0.25,-1.45; 7 0.25,-1.45; 8 0.75,-1.45; 13 0.75,1.45; 14 0.25,1.45; 15 -0.25,1.45; 16 -0.75,1.45 | smd 1.2 x 1.2: 17 0,0
VQFN100 = smd 1.05 x 0.2: 1 -5.85,4.8; 2 -5.85,4.4; 3 -5.85,4; 4 -5.85,3.6; 5 -5.85,3.2; 6 -5.85,2.8; 7 -5.85,2.4; 8 -5.85,2; 9 -5.85,1.6; 10 -5.85,1.2; 11 -5.85,0.8; 12 -5.85,0.4; 13 -5.85,0; 14 -5.85,-0.4; 15 -5.85,-0.8; 16 -5.85,-1.2; 17 -5.85,-1.6; 18 -5.85,-2; 19 -5.85,-2.4; 20 -5.85,-2.8; 21 -5.85,-3.2; 22 -5.85,-3.6; 23 -5.85,-4; 24 -5.85,-4.4; 25 -5.85,-4.8; 51 5.85,-4.8; 52 5.85,-4.4; 53 5.85,-4; 54 5.85,-3.6; 55 5.85,-3.2; 56 5.85,-2.8; 57 5.85,-2.4; 58 5.85,-2; 59 5.85,-1.6; 60 5.85,-1.2; 61 5.85,-0.8; 62 5.85,-0.4; 63 5.85,0; 64 5.85,0.4; 65 5.85,0.8; 66 5.85,1.2; 67 5.85,1.6; 68 5.85,2; 69 5.85,2.4; 70 5.85,2.8; 71 5.85,3.2; 72 5.85,3.6; 73 5.85,4; 74 5.85,4.4; 75 5.85,4.8 | smd 0.2 x 1.05: 26 -4.8,-5.85; 27 -4.4,-5.85; 28 -4,-5.85; 29 -3.6,-5.85; 30 -3.2,-5.85; 31 -2.8,-5.85; 32 -2.4,-5.85; 33 -2,-5.85; 34 -1.6,-5.85; 35 -1.2,-5.85; 36 -0.8,-5.85; 37 -0.4,-5.85; 38 0,-5.85; 39 0.4,-5.85; 40 0.8,-5.85; 41 1.2,-5.85; 42 1.6,-5.85; 43 2,-5.85; 44 2.4,-5.85; 45 2.8,-5.85; 46 3.2,-5.85; 47 3.6,-5.85; 48 4,-5.85; 49 4.4,-5.85; 50 4.8,-5.85; 76 4.8,5.85; 77 4.4,5.85; 78 4,5.85; 79 3.6,5.85; 80 3.2,5.85; 81 2.8,5.85; 82 2.4,5.85; 83 2,5.85; 84 1.6,5.85; 85 1.2,5.85; 86 0.8,5.85; 87 0.4,5.85; 88 0,5.85; 89 -0.4,5.85; 90 -0.8,5.85; 91 -1.2,5.85; 92 -1.6,5.85; 93 -2,5.85; 94 -2.4,5.85; 95 -2.8,5.85; 96 -3.2,5.85; 97 -3.6,5.85; 98 -4,5.85; 99 -4.4,5.85; 100 -4.8,5.85 | smd 8.1 x 8.1: 101 0,0
FQFN20 = smd 0.6 x 0.2: 1 -1.525,1; 2 -1.525,0.5; 3 -1.525,0; 4 -1.525,-0.5; 5 -1.525,-1; 11 1.525,-1; 12 1.525,-0.5; 13 1.525,0; 14 1.525,0.5; 15 1.525,1 | smd 0.2 x 0.6: 6 -1,-1.525; 7 -0.5,-1.525; 8 0,-1.525; 9 0.5,-1.525; 10 1,-1.525; 16 1,1.525; 17 0.5,1.525; 18 0,1.525; 19 -0.5,1.525; 20 -1,1.525 | smd 1.17 x 0.47: 21 -0.39,0.595 | smd 1.95 x 0.31: 22 0,-0.055 | smd 0.79 x 0.45: 23 -0.58,-0.701
VQFN20 = smd 0.6 x 0.25: 1 -1.5,1.25; 2 -1.5,0.75; 3 -1.5,0.25; 4 -1.5,-0.25; 5 -1.5,-0.75; 6 -1.5,-1.25; 11 1.5,-1.25; 12 1.5,-0.75; 13 1.5,-0.25; 14 1.5,0.25; 15 1.5,0.75; 16 1.5,1.25 | smd 0.25 x 0.6: 7 -0.75,-2; 8 -0.25,-2; 9 0.25,-2; 10 0.75,-2; 17 0.75,2; 18 0.25,2; 19 -0.25,2; 20 -0.75,2 | smd 1.6 x 2.6: 21 0,0
USB-C-24P-SMD-FLAT-SIDE = smd 1.25 x 0.3: A1 6.265,2.75; A2 6.265,2.25; A3 6.265,1.75; A4 6.265,1.25; A5 6.265,0.75; A6 6.265,0.25; A7 6.265,-0.25; A8 6.265,-0.75; A9 6.265,-1.25; A10 6.265,-1.75; A11 6.265,-2.25; A12 6.265,-2.75 | drill 0.4 pad 0.65: B1 4.99,-2.8; B2 4.29,-2.4; B3 4.29,-1.6; B4 4.99,-1.2; B5 4.29,-0.8; B6 4.99,-0.4; B7 4.99,0.4; B8 4.29,0.8; B9 4.99,1.2; B10 4.29,1.6; B11 4.29,2.4; B12 4.99,2.8 | drill 0.6 pad 1 long: SHIELD@0 0,4.49; SHIELD@1 4.39,4.13; SHIELD@2 4.39,-4.13; SHIELD@3 0,-4.49 | hole 0.65: 5.64,3.54; 5.64,-3.54
USB3-A-TH-FLAT-SIDE = drill 0.7 pad 1.3: D+ -1,1.5; D- 1,1.5; GND -3.5,1.5; RX+ -2,0; RX- -4,0; SS_GND 0,0; TX+ 4,0; TX- 2,0; VBUS 3.5,1.5 | drill 2.3 pad 3.3: P$10 -6.57,3.5; P$11 6.57,3.5
USB-A-TH-FLAT-SIDE = drill 0.914: D+ 2.718,-1.003; D- 2.718,1.003; GND 2.718,-3.493; VBUS 2.718,3.493 | drill 2.311: P$5 0,-6.566; P$6 0,6.566
4-SMD-3225 = smd 1.4 x 1.15: 1 -1.1,0.8; 2 1.1,0.8; 3 1.1,-0.8; 4 -1.1,-0.8

### Placement (x,y rotation side)
C1  -45,-401.3 0 top  (outside the outline)
C2  -45,-406.4 0 top  (outside the outline)
C3  -45,-411.5 0 top  (outside the outline)
C4  -45,-416.6 0 top  (outside the outline)
C5  -45,-421.7 0 top  (outside the outline)
C6  -45,-426.8 0 top  (outside the outline)
C7  -45,-431.9 0 top  (outside the outline)
C8  -45,-437 0 top  (outside the outline)
C9  -37.9,-250.3 0 top  (outside the outline)
C10  -37.9,-259.9 0 top  (outside the outline)
C11  -37.9,-231.1 0 top  (outside the outline)
C12  -37.9,-240.7 0 top  (outside the outline)
C13  -37.9,-211.9 0 top  (outside the outline)
C14  -37.9,-221.5 0 top  (outside the outline)
C15  -38.6,-78.5 0 top  (outside the outline)
C16  -38.6,-75 0 top  (outside the outline)
D1  69.3,46.8 180 top
D2  10.7,17.6 0 top
F1  -56,-467 0 top  (outside the outline)
F2  -64,-467 0 top  (outside the outline)
J1  -75,-463 0 top  (outside the outline)
Q1  76.5,48.1 0 top
Q2  9.5,24.4 0 top
Q3  76.5,44.7 0 top
Q4  9.5,21.1 0 top
R1  -44.5,-457.4 0 top  (outside the outline)
R2  -44.5,-452.3 0 top  (outside the outline)
R3  -44.5,-442.1 0 top  (outside the outline)
R4  -44.5,-396.2 0 top  (outside the outline)
R5  -44.5,-447.2 0 top  (outside the outline)
R6  -44.5,-335 0 top  (outside the outline)
R7  -44.5,-345.2 0 top  (outside the outline)
R8  -44.5,-370.7 0 top  (outside the outline)
R9  -44.5,-365.6 0 top  (outside the outline)
R10  -44.5,-360.5 0 top  (outside the outline)
R11  -44.5,-355.4 0 top  (outside the outline)
R12  -44.5,-340.1 0 top  (outside the outline)
R13  -44.5,-350.3 0 top  (outside the outline)
R14  -44.5,-296 0 top  (outside the outline)
R15  -44.5,-306.2 0 top  (outside the outline)
R16  -44.5,-301.1 0 top  (outside the outline)
R17  -44.5,-311.3 0 top  (outside the outline)
R18  -38,-178.9 0 top  (outside the outline)
R19  -38,-189.1 0 top  (outside the outline)
R20  -44.5,-285.8 0 top  (outside the outline)
R21  -44.5,-290.9 0 top  (outside the outline)
R22  -38,-199.3 0 top  (outside the outline)
R23  -38,-204.4 0 top  (outside the outline)
R24  -44.5,-375.8 0 top  (outside the outline)
R25  -44.5,-380.9 0 top  (outside the outline)
R26  -44.5,-386 0 top  (outside the outline)
R27  -44.5,-391.1 0 top  (outside the outline)
R28  -38,-82 0 top  (outside the outline)
R29  -38,-173.8 0 top  (outside the outline)
R30  -38,-163.6 0 top  (outside the outline)
R31  -38,-168.7 0 top  (outside the outline)
R32  -38,-87.1 0 top  (outside the outline)
R33  -38,-153.4 0 top  (outside the outline)
R34  -38,-158.5 0 top  (outside the outline)
R35  -38,-92.2 0 top  (outside the outline)
R36  -38,-112.6 0 top  (outside the outline)
R37  -38,-133 0 top  (outside the outline)
R38  -38,-97.3 0 top  (outside the outline)
R39  -38,-117.7 0 top  (outside the outline)
R40  -38,-138.1 0 top  (outside the outline)
R41  -38,-102.4 0 top  (outside the outline)
R42  -38,-122.8 0 top  (outside the outline)
R43  -38,-143.2 0 top  (outside the outline)
R44  -38,-107.5 0 top  (outside the outline)
R45  -38,-127.9 0 top  (outside the outline)
R46  -38,-148.3 0 top  (outside the outline)
R47  -47,-463 0 top  (outside the outline)
R48  -47,-469 0 top  (outside the outline)
SJ1  -50.3,-457.9 0 top  (outside the outline)
U1  18.8,47.1 180 top
U2  23.5,22.2 270 top
U3  64.1,22.4 270 top
U4  43.1,22.4 270 top
U5  84.8,20.8 270 top
U6  84.3,48.6 0 top
U7  9.3,13.7 90 top
U8  84.5,42.7 0 top
U9  5.6,17.3 0 top
U10  49.4,37 0 top
U11  18.5,35.3 0 top
U12  23.6,35.3 0 top
USB1  2.6,47 0 top
USB2  28.3,15.3 180 top
USB3  68.3,15.2 180 top
USB4  48,10.2 90 top
USB5  89.1,10.2 90 top
USB6  97.4,47 180 top
USB7  9.3,2.6 90 top
X1  37.3,40.8 0 top

### Tracks (layer width: path | path; a pad name or v marks a point on that pad's centre or on a via)
1V2  (10 unrouted)
3V3  (14 unrouted)
5V0  (17 unrouted)
!DN1_VC1_EN  (2 unrouted)
!DN1_VC2_EN  (2 unrouted)
!DN2_VC1_EN  (2 unrouted)
!DN2_VC2_EN  (2 unrouted)
!SPI_CS  (1 unrouted)
DN1_ATTACH  (2 unrouted)
DN1_CC1  (3 unrouted)
DN1_CC2  (3 unrouted)
DN1_D+  (3 unrouted)
DN1_D-  (3 unrouted)
DN1_DIR  (2 unrouted)
DN1_EN/!OC_DET  (3 unrouted)
DN1_PWR_EN  (2 unrouted)
DN1_RXA+  (1 unrouted)
DN1_RXA-  (1 unrouted)
DN1_RXB+  (1 unrouted)
DN1_RXB-  (1 unrouted)
DN1_TXA+  (1 unrouted)
DN1_TXA-  (1 unrouted)
DN1_TXB+  (1 unrouted)
DN1_TXB-  (1 unrouted)
DN1_VMON  (2 unrouted)
DN2_ATTACH  (2 unrouted)
DN2_CC1  (3 unrouted)
DN2_CC2  (3 unrouted)
DN2_D+  (3 unrouted)
DN2_D-  (3 unrouted)
DN2_DIR  (2 unrouted)
DN2_EN/!OC_DET  (3 unrouted)
DN2_PWR_EN  (2 unrouted)
DN2_RXA+  (1 unrouted)
DN2_RXA-  (1 unrouted)
DN2_RXB+  (1 unrouted)
DN2_RXB-  (1 unrouted)
DN2_TXA+  (1 unrouted)
DN2_TXA-  (1 unrouted)
DN2_TXB+  (1 unrouted)
DN2_TXB-  (1 unrouted)
DN2_VMON  (2 unrouted)
DN3_D+  (2 unrouted)
DN3_D-  (2 unrouted)
DN3_EN/!OC_DET  (2 unrouted)
DN3_RX+  (1 unrouted)
DN3_RX-  (1 unrouted)
DN3_TX+  (1 unrouted)
DN3_TX-  (1 unrouted)
DN4_D+  (2 unrouted)
DN4_D-  (2 unrouted)
DN4_EN/!OC_DET  (2 unrouted)
DN4_RX+  (1 unrouted)
DN4_RX-  (1 unrouted)
DN4_TX+  (1 unrouted)
DN4_TX-  (1 unrouted)
DN5_D+  (2 unrouted)
DN5_D-  (2 unrouted)
DN5_EN/!OC_DET  (2 unrouted)
DN6_D+  (2 unrouted)
DN6_D-  (2 unrouted)
DN6_EN/!OC_DET  (2 unrouted)
GND  (88 unrouted)
  pour Top (rank 6): -4,64 104,64 104,-4 -4,-4
  pour Bottom (rank 6): -6,66 105,66 105,-6 -6,-6
I2C_SCL  (1 unrouted)
I2C_SDA  (1 unrouted)
N$1  (1 unrouted)
N$2  (1 unrouted)
N$3  (1 unrouted)
N$4  (1 unrouted)
N$5  (1 unrouted)
N$6  (1 unrouted)
N$7  (1 unrouted)
N$8  (1 unrouted)
N$9  (1 unrouted)
N$10  (1 unrouted)
N$11  (2 unrouted)
N$12  (3 unrouted)
N$13  (2 unrouted)
N$14  (2 unrouted)
N$15  (2 unrouted)
N$16  (2 unrouted)
N$17  (2 unrouted)
N$18  (2 unrouted)
N$19  (1 unrouted)
N$20  (1 unrouted)
N$21  (2 unrouted)
N$22  (1 unrouted)
N$23  (2 unrouted)
N$24  (2 unrouted)
N$25  (2 unrouted)
N$27  (1 unrouted)
N$28  (1 unrouted)
N$29  (1 unrouted)
SPI_MISO  (1 unrouted)
UP_ATTACH  (1 unrouted)
UP_CC1  (1 unrouted)
UP_CC2  (1 unrouted)
UP_D+  (2 unrouted)
UP_D-  (2 unrouted)
UP_RX1+  (1 unrouted)
UP_RX1-  (1 unrouted)
UP_RX2+  (1 unrouted)
UP_RX2-  (1 unrouted)
UP_RX+  (1 unrouted)
UP_RX-  (1 unrouted)
UP_TX1+  (1 unrouted)
UP_TX1-  (1 unrouted)
UP_TX2+  (1 unrouted)
UP_TX2-  (1 unrouted)
UP_TX+  (1 unrouted)
UP_TX-  (1 unrouted)
UP_VBUS_DET  (3 unrouted)
VBUS  (2 unrouted)